# Altium schematic sheet Sensors.SchDoc
size 635 x 279 mm
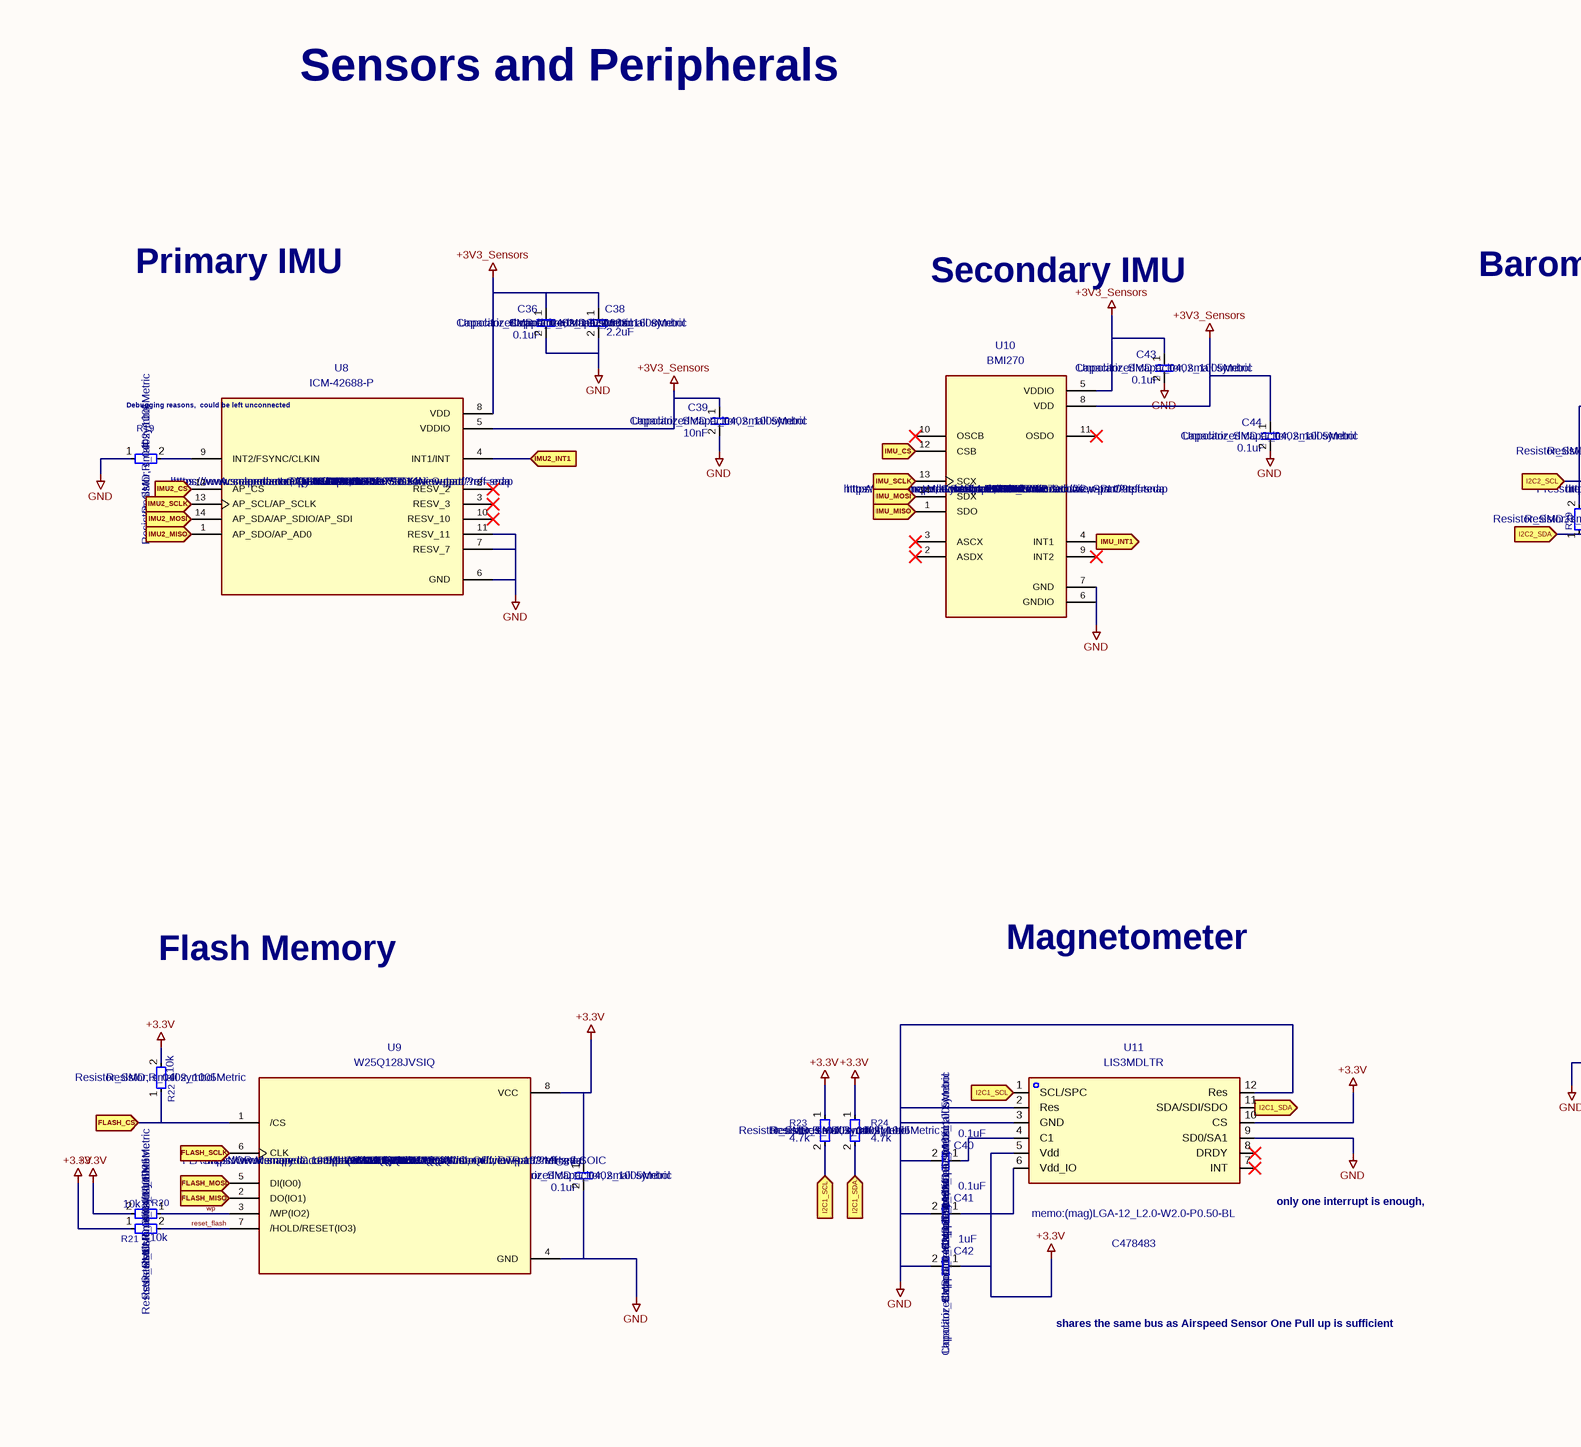
[diagram p0: Sensors.SchDoc, left]
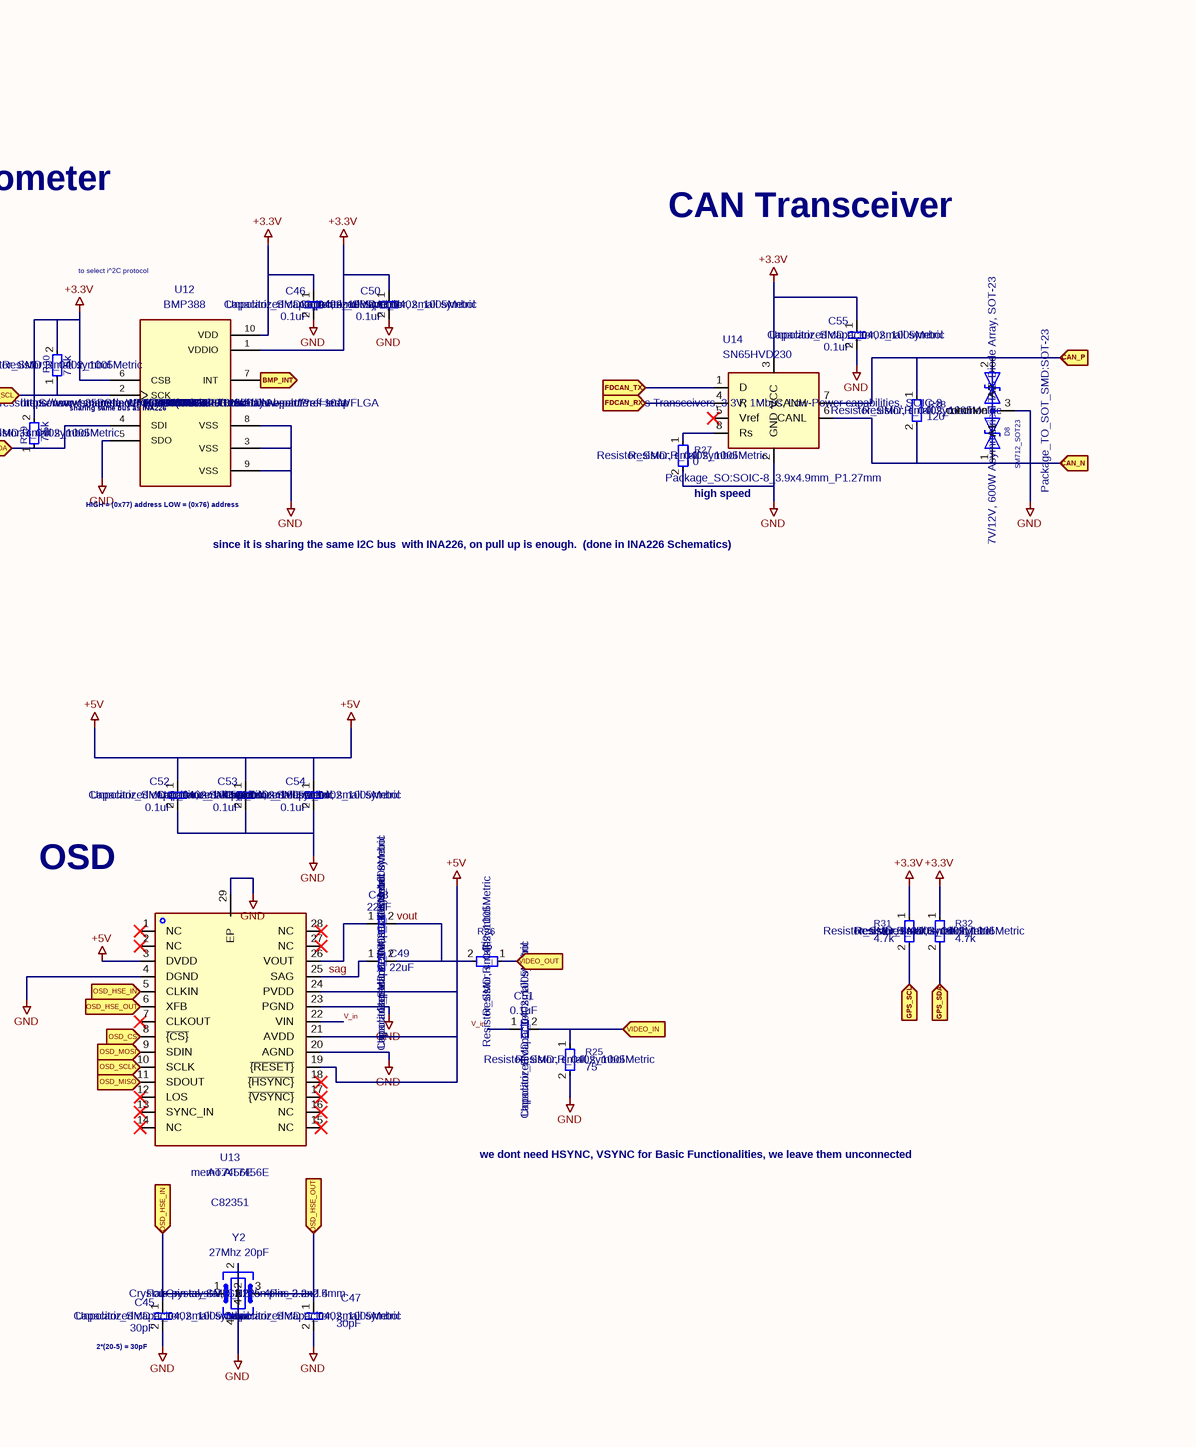
[diagram p1: Sensors.SchDoc, middle]
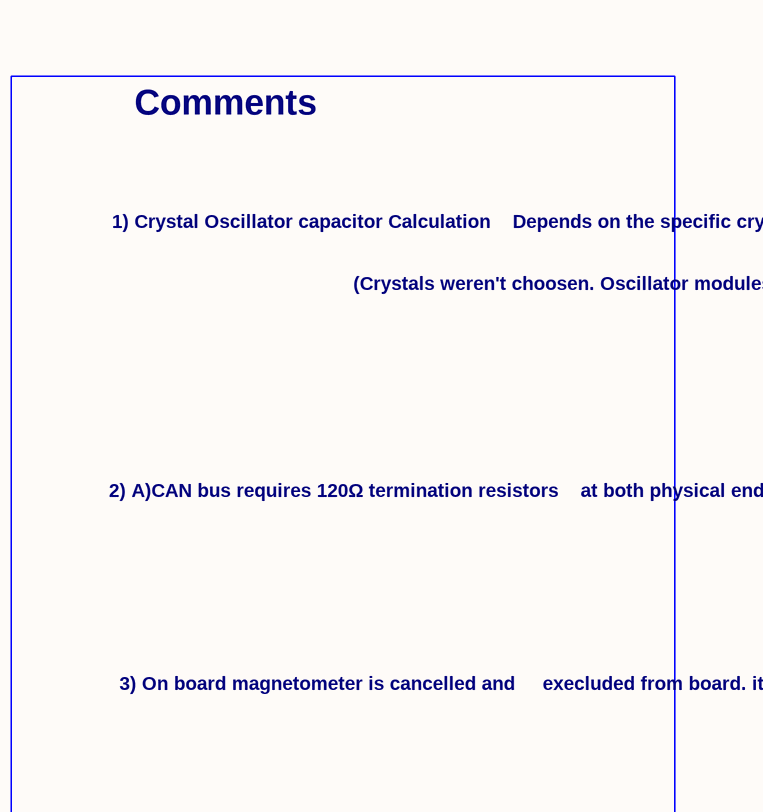
[diagram p2: Sensors.SchDoc, right]

## Parts
C36  Description: Unpolarized capacitor, small symbol  Footprint: Capacitor_SMD:C_0402_1005Metric  [C_0402_1005Metric]  (hidden comment: 0.1uF)
C37  Description: Unpolarized capacitor, small symbol  Footprint: Capacitor_SMD:C_0402_1005Metric  [C_0402_1005Metric]  (hidden comment: 0.1uF)
C38  Description: Unpolarized capacitor, small symbol  Footprint: Capacitor_SMD:C_0603_1608Metric  [C_0603_1608Metric]  (hidden comment: 2.2uF)
C39  Description: Unpolarized capacitor, small symbol  Footprint: Capacitor_SMD:C_0402_1005Metric  [C_0402_1005Metric]  (hidden comment: 10nF)
C40  Description: Unpolarized capacitor, small symbol  Footprint: Capacitor_SMD:C_0402_1005Metric  [C_0402_1005Metric]  (hidden comment: 0.1uF)
C41  Description: Unpolarized capacitor, small symbol  Footprint: Capacitor_SMD:C_0402_1005Metric  [C_0402_1005Metric]  (hidden comment: 0.1uF)
C42  Description: Unpolarized capacitor, small symbol  Footprint: Capacitor_SMD:C_0402_1005Metric  [C_0402_1005Metric]  (hidden comment: 1uF)
C43  Description: Unpolarized capacitor, small symbol  Footprint: Capacitor_SMD:C_0402_1005Metric  [C_0402_1005Metric]  (hidden comment: 0.1uF)
C44  Description: Unpolarized capacitor, small symbol  Footprint: Capacitor_SMD:C_0402_1005Metric  [C_0402_1005Metric]  (hidden comment: 0.1uF)
C45  Description: Unpolarized capacitor, small symbol  Footprint: Capacitor_SMD:C_0402_1005Metric  [C_0402_1005Metric]  (hidden comment: 30pF)
C46  Description: Unpolarized capacitor, small symbol  Footprint: Capacitor_SMD:C_0402_1005Metric  [C_0402_1005Metric]  (hidden comment: 0.1uF)
C47  Description: Unpolarized capacitor, small symbol  Footprint: Capacitor_SMD:C_0402_1005Metric  [C_0402_1005Metric]  (hidden comment: 30pF)
C48  Description: Unpolarized capacitor, small symbol  Footprint: Capacitor_SMD:C_0603_1608Metric  [C_0603_1608Metric]  (hidden comment: 22uF)
C49  Description: Unpolarized capacitor, small symbol  Footprint: Capacitor_SMD:C_0603_1608Metric  [C_0603_1608Metric]  (hidden comment: 22uF)
C50  Description: Unpolarized capacitor, small symbol  Footprint: Capacitor_SMD:C_0402_1005Metric  [C_0402_1005Metric]  (hidden comment: 0.1uF)
C51  Description: Unpolarized capacitor, small symbol  Footprint: Capacitor_SMD:C_0402_1005Metric  [C_0402_1005Metric]  (hidden comment: 0.1uF)
C52  Description: Unpolarized capacitor, small symbol  Footprint: Capacitor_SMD:C_0402_1005Metric  [C_0402_1005Metric]  (hidden comment: 0.1uF)
C53  Description: Unpolarized capacitor, small symbol  Footprint: Capacitor_SMD:C_0402_1005Metric  [C_0402_1005Metric]  (hidden comment: 0.1uF)
C54  Description: Unpolarized capacitor, small symbol  Footprint: Capacitor_SMD:C_0402_1005Metric  [C_0402_1005Metric]  (hidden comment: 0.1uF)
C55  Description: Unpolarized capacitor, small symbol  Footprint: Capacitor_SMD:C_0402_1005Metric  [C_0402_1005Metric]  (hidden comment: 0.1uF)
D8  Description: 7V/12V, 600W Asymmetrical TVS Diode Array, SOT-23  Footprint: Package_TO_SOT_SMD:SOT-23  [SOT-23]  (hidden comment: SM712_SOT23)
R19  Description: Resistor, small symbol  Footprint: Resistor_SMD:R_0402_1005Metric  [R_0402_1005Metric]  (hidden comment: 0)
R20  Description: Resistor, small symbol  Footprint: Resistor_SMD:R_0402_1005Metric  [R_0402_1005Metric]  (hidden comment: 10k)
R21  Description: Resistor, small symbol  Footprint: Resistor_SMD:R_0402_1005Metric  [R_0402_1005Metric]  (hidden comment: 10k)
R22  Description: Resistor, small symbol  Footprint: Resistor_SMD:R_0402_1005Metric  [R_0402_1005Metric]  (hidden comment: 10k)
R23  Description: Resistor, small symbol  Footprint: Resistor_SMD:R_0402_1005Metric  [R_0402_1005Metric]  (hidden comment: 4.7k)
R24  Description: Resistor, small symbol  Footprint: Resistor_SMD:R_0402_1005Metric  [R_0402_1005Metric]  (hidden comment: 4.7k)
R25  Description: Resistor, small symbol  Footprint: Resistor_SMD:R_0402_1005Metric  [R_0402_1005Metric]  (hidden comment: 75)
R26  Description: Resistor, small symbol  Footprint: Resistor_SMD:R_0402_1005Metric  [R_0402_1005Metric]  (hidden comment: 75)
R27  Description: Resistor, small symbol  Footprint: Resistor_SMD:R_0402_1005Metric  [R_0402_1005Metric]  (hidden comment: 0)
R28  Description: Resistor, small symbol  Footprint: Resistor_SMD:R_0402_1005Metric  [R_0402_1005Metric]  (hidden comment: 120)
R29  Description: Resistor, small symbol  Footprint: Resistor_SMD:R_0402_1005Metric  [R_0402_1005Metric]  (hidden comment: 7.5k)
R30  Description: Resistor, small symbol  Footprint: Resistor_SMD:R_0402_1005Metric  [R_0402_1005Metric]  (hidden comment: 7.5k)
R31  Description: Resistor, small symbol  Footprint: Resistor_SMD:R_0402_1005Metric  [R_0402_1005Metric]  (hidden comment: 4.7k)
R32  Description: Resistor, small symbol  Footprint: Resistor_SMD:R_0402_1005Metric  [R_0402_1005Metric]  (hidden comment: 4.7k)
U8  MF: TDK InvenSense  MAXIMUM_PACKAGE_HEIGHT: 0.97mm  Package: LGA-14 TDK InvenSense  Price: None  STANDARD: IPC-7351B  PARTREV: 1.2  Description_1: Accelerometer, Gyroscope, 6 Axis Sensor - Output  Availability: In Stock  Footprint: memo:PQFN50P300X250X97-14N  [PQFN50P300X250X97-14N]  (hidden comment: ICM-42688-P)
U9  MF: Winbond Electronics  MAXIMUM_PACKAGE_HEIGHT: 2.16 mm  Package: SOIC-8 Winbond Electronics  Price: None  STANDARD: IPC-7351B  PARTREV: I  Description_1: FLASH - NOR Memory IC 128Mb (16M x 8) SPI - Quad I/O, QPI, DTR 133 MHz 8-SOIC  Availability: In Stock  Footprint: memo:W25Q128JVSIQ  [W25Q128JVSIQ]  (hidden comment: W25Q128JVSIQ)
U10  PATREV: 1.0  MF: Bosch Sensortec  MAXIMUM_PACKAGE_HEIGHT: 0.87mm  Package: LGA-14 Bosch Sensortec  Price: None  STANDARD: Manufacturer Recommendations  Description_1: Accelerometer, Gyroscope, 6 Axis Sensor I2C, SPI Output  Availability: In Stock  Footprint: memo:XDCR_BMI270  [XDCR_BMI270]  (hidden comment: BMI270)
U11  LCSC Part: C478483  Footprint: memo:(mag)LGA-12_L2.0-W2.0-P0.50-BL  [(mag)LGA-12_L2.0-W2.0-P0.50-BL]  (hidden comment: LIS3MDLTR)
U12  MF: Bosch Sensortec  Description_1: Pressure Sensor 4.35PSI ~ 18.13PSI (30kPa ~ 125kPa) Absolute - - 10-WFLGA  Package: WFLGA-10 Bosch Tools  Price: None  STANDARD: IPC 7351B  PARTREV: 1.1  Availability: In Stock  MANUFACTURER: BOSCH  Footprint: memo:PQFN50P200X200X80-10N  [PQFN50P200X200X80-10N]  (hidden comment: BMP388)
U13  LCSC Part: C82351  Footprint: memo:AT7456E  [AT7456E]  (hidden comment: AT7456E)
U14  Description: CAN Bus Transceivers, 3.3V, 1Mbps, Low-Power capabilities, SOIC-8  Footprint: Package_SO:SOIC-8_3.9x4.9mm_P1.27mm  [SOIC-8_3.9x4.9mm_P1.27mm]  (hidden comment: SN65HVD230)
Y2  Description: Four pin crystal, GND on pins 2 and 4  Footprint: Crystal:Crystal_SMD_3225-4Pin_3.2x2.5mm  [Crystal_SMD_3225-4Pin_3.2x2.5mm]  (hidden comment: 27Mhz 20pF)

## Ports
BMP_INT (in), CAN_N (in), CAN_P (in), FDCAN_RX (in), FDCAN_TX (in), FLASH_CS (in), FLASH_MISO (in), FLASH_MOSI (in), FLASH_SCLK (in), GPS_SCL (in), GPS_SDA (in), I2C1_SCL (in), I2C1_SDA (in), I2C2_SCL (in), I2C2_SDA (in), IMU2_CS (in), IMU2_INT1 (in), IMU2_MISO (in), IMU2_MOSI (in), IMU2_SCLK (in), IMU_CS (in), IMU_INT1 (in), IMU_MISO (in), IMU_MOSI (in), IMU_SCLK (in), OSD_CS (in), OSD_HSE_IN (in), OSD_HSE_OUT (in), OSD_MISO (in), OSD_MOSI (in), OSD_SCLK (in), VIDEO_IN (in), VIDEO_OUT (in)

## Nets
+3.3V: C37.1 C41.1 C42.1 C46.1 C50.1 C55.1 R20.2 R21.1 R22.2 R23.1 R24.1 R29.2 R30.2 R31.1 R32.1 U9.8(VCC) U11.5(Vdd) U11.6(Vdd_IO) U11.10(CS) U12.1(VDDIO) U12.6(CSB) U12.10(VDD) U14.3(VCC)
+3V3_Sensors: C36.1 C38.1 C39.1 C43.1 C44.1 U8.5(VDDIO) U8.8(VDD) U10.5(VDDIO) U10.8(VDD)
+5V: C52.1 C53.1 C54.1 U13.3(DVDD) U13.19(~{{RESET}}) U13.21(AVDD) U13.24(PVDD)
GND: C36.2 C37.2 C38.2 C39.2 C40.2 C41.2 C42.2 C43.2 C44.2 C45.2 C46.2 C47.2 C50.2 C52.2 C53.2 C54.2 C55.2 D8.3(common) R19.1 R25.2 R27.2 U8.6(GND) U8.7(RESV_7) U8.11(RESV_11) U9.4(GND) U10.6(GNDIO) U10.7(GND) U11.2(Res) U11.3(GND) U11.9(SD0/SA1) U11.12(Res) U12.3(VSS) U12.5(SDO) U12.8(VSS) U12.9(VSS) U13.4(DGND) U13.20(AGND) U13.23(PGND) U13.29(EP) U14.2(GND) Y2.2 Y2.4
BMP_INT: U12.7(INT) ; port BMP_INT
CAN_N: D8.1(A1) R28.2 U14.6(CANL) ; port CAN_N
CAN_P: D8.2(A2) R28.1 U14.7(CANH) ; port CAN_P
FDCAN_RX: U14.4(R) ; port FDCAN_RX
FDCAN_TX: U14.1(D) ; port FDCAN_TX
FLASH_CS: R22.1 U9.1(/CS) ; port FLASH_CS
FLASH_MISO: U9.2(DO(IO1)) ; port FLASH_MISO
FLASH_MOSI: U9.5(DI(IO0)) ; port FLASH_MOSI
FLASH_SCLK: U9.6(CLK) ; port FLASH_SCLK
GPS_SCL: R31.2 ; port GPS_SCL
GPS_SDA: R32.2 ; port GPS_SDA
I2C1_SCL: R23.2 U11.1(SCL/SPC) ; port I2C1_SCL
I2C1_SDA: R24.2 U11.11(SDA/SDI/SDO) ; port I2C1_SDA
I2C2_SCL: R30.1 U12.2(SCK) ; port I2C2_SCL
I2C2_SDA: R29.1 U12.4(SDI) ; port I2C2_SDA
IMU2_CS: U8.12(AP_CS) ; port IMU2_CS
IMU2_INT1: U8.4(INT1/INT) ; port IMU2_INT1
IMU2_MISO: U8.1(AP_SDO/AP_AD0) ; port IMU2_MISO
IMU2_MOSI: U8.14(AP_SDA/AP_SDIO/AP_SDI) ; port IMU2_MOSI
IMU2_SCLK: U8.13(AP_SCL/AP_SCLK) ; port IMU2_SCLK
IMU_CS: U10.12(CSB) ; port IMU_CS
IMU_INT1: U10.4(INT1) ; port IMU_INT1
IMU_MISO: U10.1(SDO) ; port IMU_MISO
IMU_MOSI: U10.14(SDX) ; port IMU_MOSI
IMU_SCLK: U10.13(SCX) ; port IMU_SCLK
OSD_CS: U13.8(~{{CS}}) ; port OSD_CS
OSD_HSE_IN: C45.1 U13.5(CLKIN) Y2.1 ; port OSD_HSE_IN
OSD_HSE_OUT: C47.1 U13.6(XFB) Y2.3 ; port OSD_HSE_OUT
OSD_MISO: U13.11(SDOUT) ; port OSD_MISO
OSD_MOSI: U13.9(SDIN) ; port OSD_MOSI
OSD_SCLK: U13.10(SCLK) ; port OSD_SCLK
reset_flash: R21.2 U9.7(/HOLD/RESET(IO3))
sag: C49.1 U13.25(SAG)
V_in: C51.1 U13.22(VIN)
VIDEO_IN: C51.2 R25.1 ; port VIDEO_IN
VIDEO_OUT: R26.1 ; port VIDEO_OUT
vout: C48.2 C49.2 R26.2
wp: R20.1 U9.3(/WP(IO2))
NetC40_1: C40.1 U11.4(C1)
NetC48_1: C48.1 U13.26(VOUT)
NetR19_2: R19.2 U8.9(INT2/FSYNC/CLKIN)
NetR27_1: R27.1 U14.8(Rs)

Not connected (* = marked no-connect by the designer): U8 2(RESV_2)* 3(RESV_3)* 10(RESV_10)*; U10 2(ASDX)* 3(ASCX)* 9(INT2)* 10(OSCB)* 11(OSDO)*; U11 7(INT)* 8(DRDY)*; U13 1(NC)* 2(NC)* 7(CLKOUT)* 12(LOS)* 13(SYNC_IN)* 14(NC)* 15(NC)* 16(NC)* 17(~{{VSYNC}})* 18(~{{HSYNC}})* 27(NC)* 28(NC)*; U14 5(Vref)*

## Notes on the sheet
- Sensors and Peripherals
- Comments
- Primary IMU
- Secondary IMU
- Barometer
- 1) Crystal Oscillator capacitor Calculation
  Depends on the specific crystal capacitance
  and stray capacitance. Take stray capacitance
  to be 3 - 5 pF.
- (Crystals weren't choosen. Oscillator modules
  for reliable clock generation)
- to select i^2C protocol
- CAN Transceiver
- (near U8) Debugging reasons,
  could be left unconnected
- (near U12) sharing same bus as INA226
- 2) A)CAN bus requires 120Ω termination resistors
  at both physical ends of the bus only.
  If the flight controller is positioned in
  the middle of the CAN chain, no termination
  should be installed. Populate R30 only
  if the flight controller is at one end of the bus.
  B) 0Ω Resistor on RS for slope control,
  now its configured for High speed. If
  the wires are long then 10kΩ - 100kΩ
  should be used
- (near U12) HIGH = (0x77) address
  LOW = (0x76) address
- high speed
- since it is sharing the same I2C bus
  with INA226, on pull up is enough.
  (done in INA226 Schematics)
- 3) On board magnetometer is cancelled and
  execluded from board. it is much more stable
  as an external module paired with GPS
  or individually.
- Flash Memory
- Magnetometer
- OSD
- (near U11) only one interrupt is enough,
- we dont need HSYNC, VSYNC for Basic
  Functionalities, we leave them unconnected
- shares the same bus as Airspeed Sensor
  One Pull up is sufficient
- (near C45) 2*(20-5) = 30pF
- 1
- 2
- 3
- 4
- 5
- 6
- 7
- 8
- 9
- 10
- 11
- 12
- A
- B
- C
- D
- E
- Title:
- File: Sensors.kicad_sch
- Sheet: /
- KiCad E.D.A.  kicad (5.1.4)-1
- Size: User
- Date:
- Rev:
- Id: 1/1

## Library data of the parts
C36-C55 = C_Small
  C36 C37 C40 C41 C43 C44 C46 C50-C55: Value: 0.1uF
  C38: Value: 2.2uF
  C39: Value: 10nF
  C42: Value: 1uF
  C45 C47: Value: 30pF
  C48 C49: Value: 22uF
R19-R32 = R_Small
  R19 R27: Value: 0
  R20-R22: Value: 10k
  R23 R24 R31 R32: Value: 4.7k
  R25 R26: Value: 75
  R28: Value: 120
  R29 R30: Value: 7.5k
Y2 = Crystal_GND24: Value: 27Mhz 20pF
D8 = SM712_SOT23: Value: SM712_SOT23
U8 = ICM-42688-P: Check_prices: https://www.snapeda.com/parts/ICM-42688-P/TDK/view-part/?ref=eda; SnapEDA_Link: https://www.snapeda.com/parts/ICM-42688-P/TDK/view-part/?ref=snap; MP: ICM-42688-P; MANUFACTURER: TDK InvenSense; Value: ICM-42688-P
U9 = W25Q128JVSIQ: Check_prices: https://www.snapeda.com/parts/W25Q128JVSIQ/Winbond/view-part/?ref=eda; SnapEDA_Link: https://www.snapeda.com/parts/W25Q128JVSIQ/Winbond/view-part/?ref=snap; MP: W25Q128JVSIQ; MANUFACTURER: Winbond Electronics; Value: W25Q128JVSIQ
U10 = BMI270: Check_prices: https://www.snapeda.com/parts/BMI270/Bosch/view-part/?ref=eda; SnapEDA_Link: https://www.snapeda.com/parts/BMI270/Bosch/view-part/?ref=snap; MP: BMI270; MANUFACTURER: Bosch Sensortec; Value: BMI270
U11 = LIS3MDLTR: Value: LIS3MDLTR
U12 = BMP388: Check_prices: https://www.snapeda.com/parts/BMP388/Bosch/view-part/?ref=eda; SnapEDA_Link: https://www.snapeda.com/parts/BMP388/Bosch/view-part/?ref=snap; MP: BMP388; Value: BMP388
U13 = AT7456E: Value: AT7456E
U14 = SN65HVD230: Value: SN65HVD230